# Altium schematic sheet OSSI-1 COMMS_3.SchDoc: TITLE:
size 410 x 286 mm; Date: Date:; >LAST_DATE_TIME: 01/11/2015 13:25:23; Sheet:: Sheet:; >SHEET: 4; REV:: REV:; Document Number:: Document Number:; >DRAWING_NAME: OSSI-1 COMMS.sch
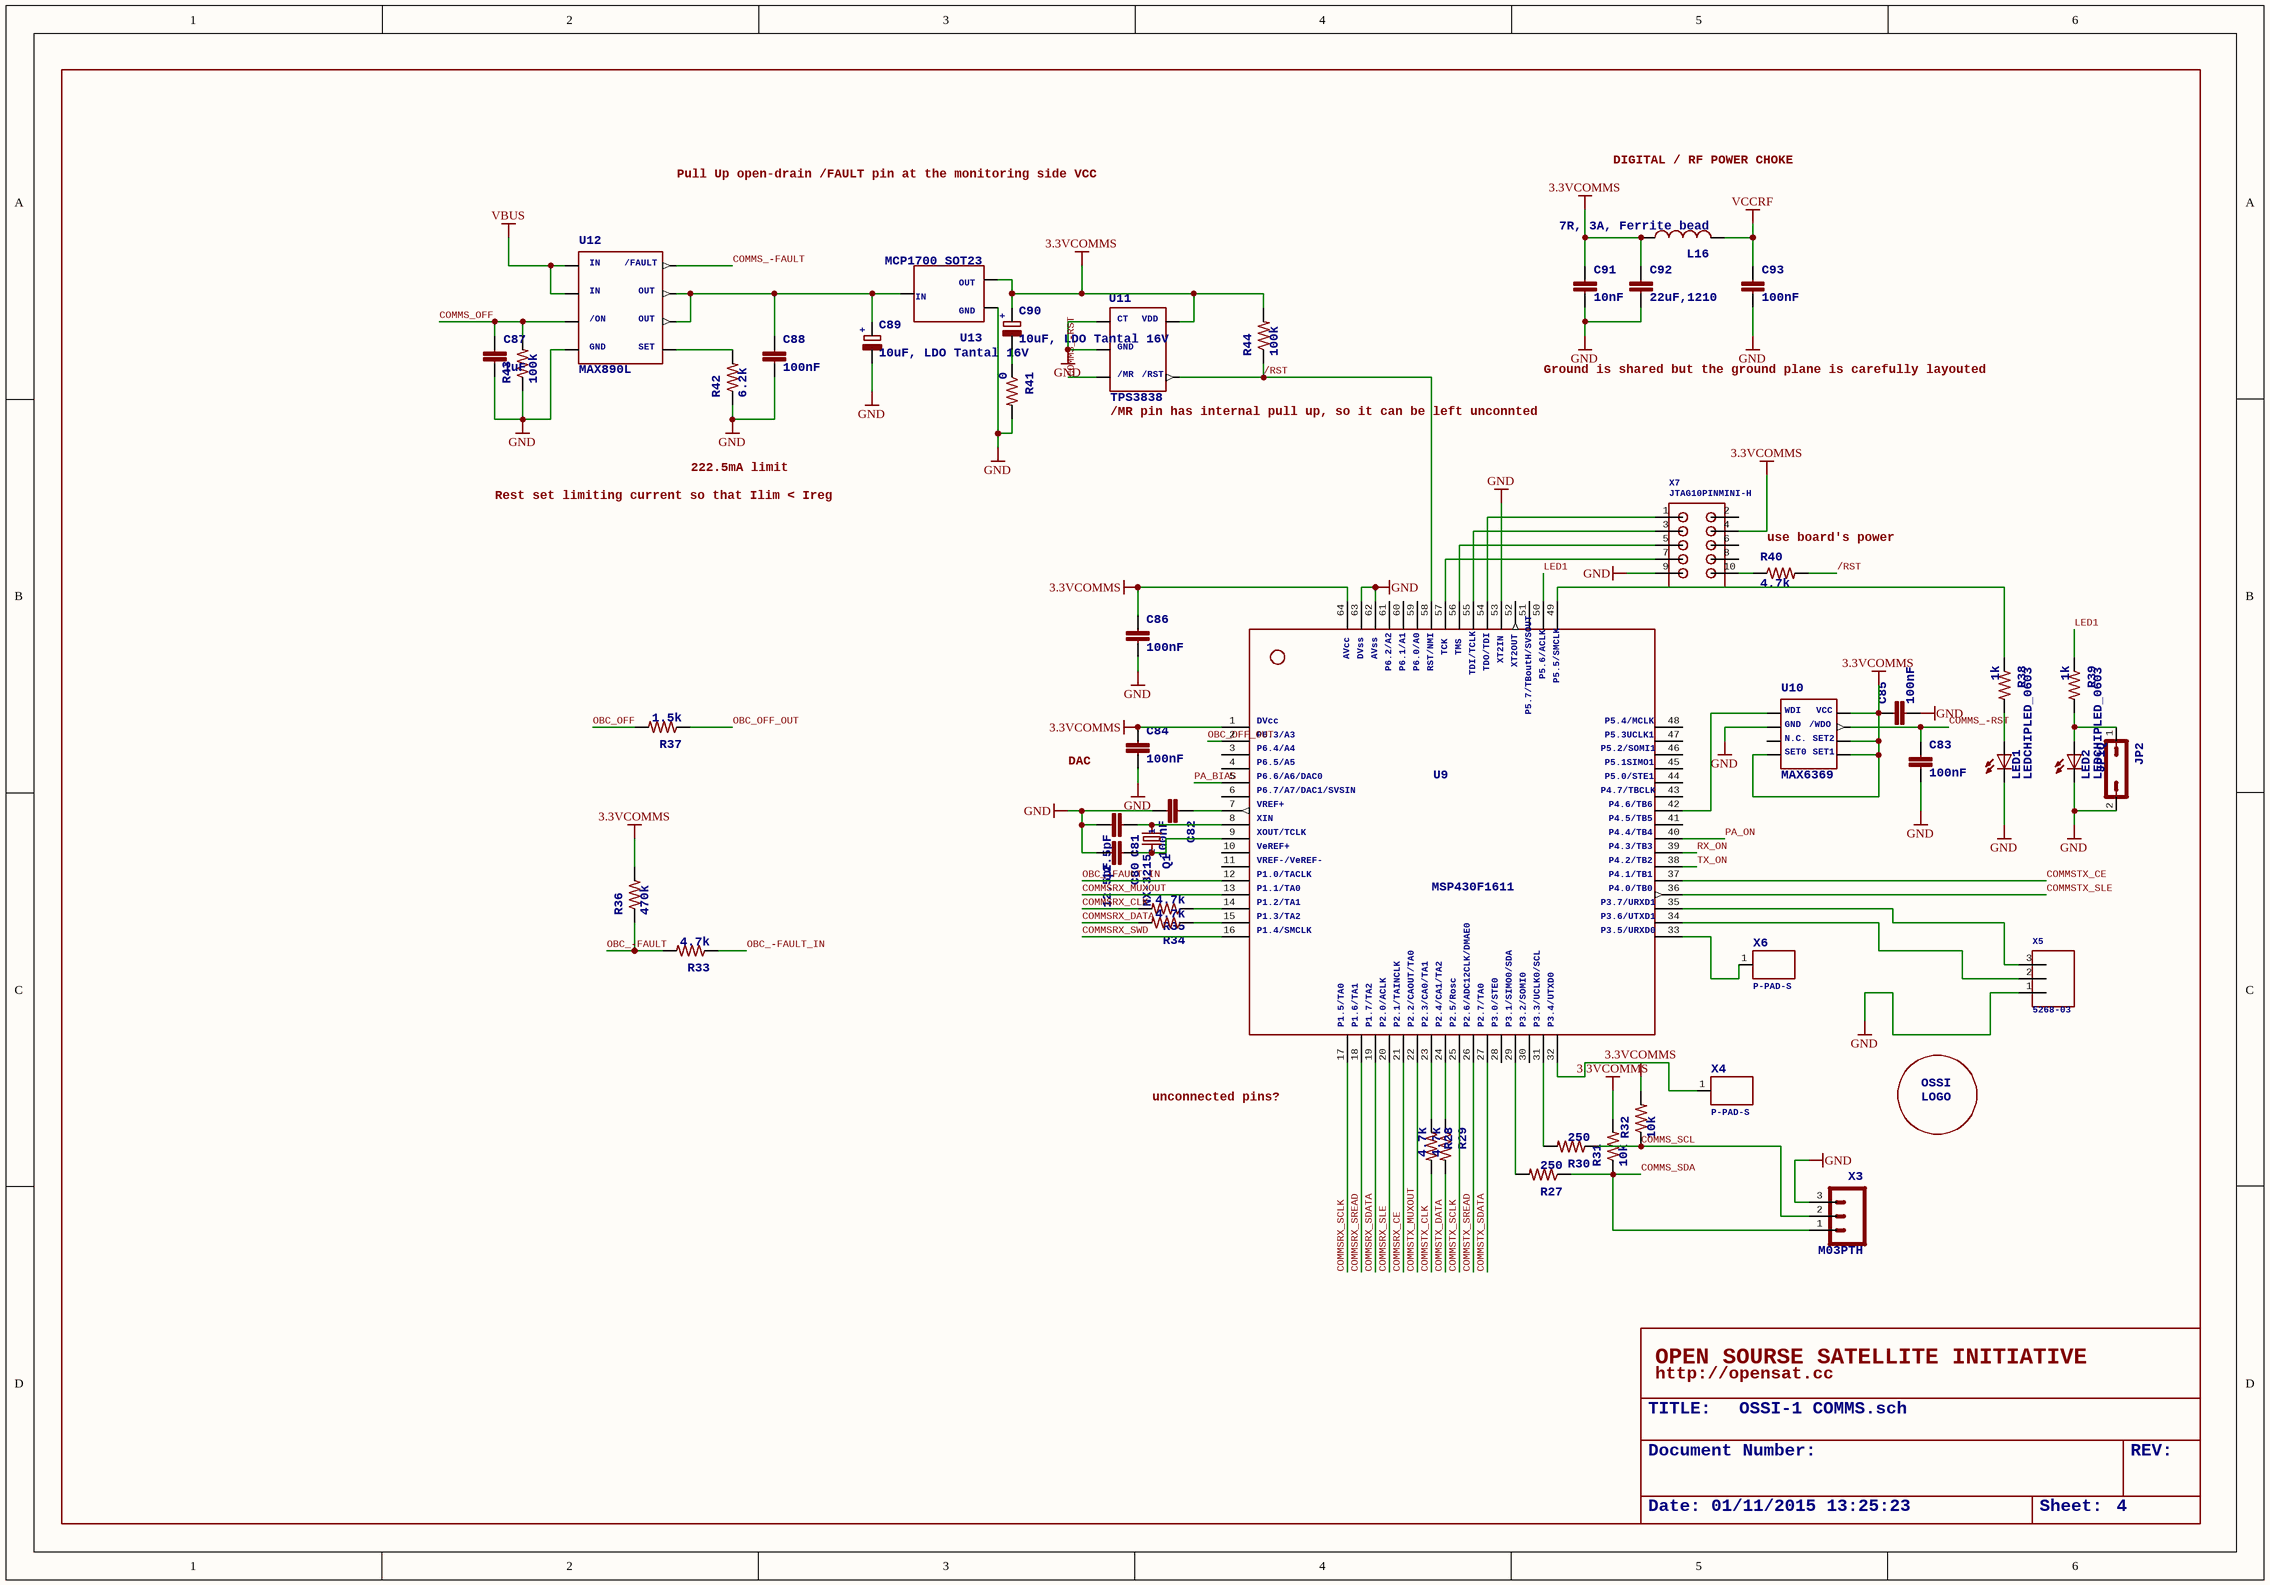
[diagram p0: OSSI-1 COMMS_3.SchDoc]

## Parts
C80  >NAME: C80  [C0603(1608)]  (hidden comment: 12.5pF)
C81  >NAME: C81  [C0603(1608)]  (hidden comment: 12.5pF)
C82  >NAME: C82  [C0603(1608)]  (hidden comment: 100nF)
C83  >NAME: C83  [C0603(1608)]  (hidden comment: 100nF)
C84  >NAME: C84  [C0603(1608)]  (hidden comment: 100nF)
C85  >NAME: C85  [C0603(1608)]  (hidden comment: 100nF)
C86  >NAME: C86  [C0603(1608)]  (hidden comment: 100nF)
C87  >NAME: C87  [C0603(1608)]  (hidden comment: 1uF)
C88  >NAME: C88  [C0603(1608)]  (hidden comment: 100nF)
C89  >NAME: C89  [C1206(3216)-A]  (hidden comment: 10uF, LDO Tantal 16V)
C90  >NAME: C90  [C1206(3216)-A]  (hidden comment: 10uF, LDO Tantal 16V)
C91  >NAME: C91  [C0603(1608)]  (hidden comment: 10nF)
C92  >NAME: C92  [C1210-GCM32]  (hidden comment: 22uF,1210)
C93  >NAME: C93  [C0603(1608)]  (hidden comment: 100nF)
JP2  >NAME: JP2  [JP1]  (hidden comment: JP1Q)
L16  >NAME: L16  [L0805(2012)]  (hidden comment: 7R, 3A, Ferrite bead)
LED1  >NAME: LED1  [CHIPLED_0603]  (hidden comment: LEDCHIPLED_0603)
LED2  >NAME: LED2  [CHIPLED_0603]  (hidden comment: LEDCHIPLED_0603)
Q1  >NAME: Q1  [NX-3215]  (hidden comment: NX-3215)
R27  >NAME: R27  [R0603(1608)]  (hidden comment: 250)
R28  >NAME: R28  [R0603(1608)]  (hidden comment: 4.7k)
R29  >NAME: R29  [R0603(1608)]  (hidden comment: 4.7k)
R30  >NAME: R30  [R0603(1608)]  (hidden comment: 250)
R31  >NAME: R31  [R0603(1608)]  (hidden comment: 10k)
R32  >NAME: R32  [R0603(1608)]  (hidden comment: 10k)
R33  >NAME: R33  [R0603(1608)]  (hidden comment: 4.7k)
R34  >NAME: R34  [R0603(1608)]  (hidden comment: 4.7k)
R35  >NAME: R35  [R0603(1608)]  (hidden comment: 4.7k)
R36  >NAME: R36  [R0603(1608)]  (hidden comment: 470k)
R37  >NAME: R37  [R0603(1608)]  (hidden comment: 1.5k)
R38  >NAME: R38  [R0603(1608)]  (hidden comment: 1k)
R39  >NAME: R39  [R0603(1608)]  (hidden comment: 1k)
R40  >NAME: R40  [R0603(1608)]  (hidden comment: 4.7k)
R41  >NAME: R41  [R0603(1608)]  (hidden comment: 0)
R42  >NAME: R42  [R0603(1608)]  (hidden comment: 6.2k)
R43  >NAME: R43  [R0603(1608)]  (hidden comment: 100k)
R44  >NAME: R44  [R0603(1608)]  (hidden comment: 100k)
U9  >NAME: U9  [PM/PAG64]  (hidden comment: MSP430F1611)
U10  >NAME: U10  [SOT23-8]  (hidden comment: MAX6369)
U11  >NAME: U11  [SOT23-5DBV]  (hidden comment: TPS3838)
U12  >NAME: U12  [SO8]  (hidden comment: MAX890L)
U13  >NAME: U13  [SOT23]  (hidden comment: MCP1700_SOT23)
U$1  OSSILOGORECT  [OSSILOGORECT1005]  (value not drawn)
X3  >NAME: X3  [1X03]  (hidden comment: M03PTH)
X4  >NAME: X4  [P-PAD-S]  (hidden comment: P-PAD-S)
X5  >NAME: X5  [5268-03]  (hidden comment: 5268-03)
X6  >NAME: X6  [P-PAD-S]  (hidden comment: P-PAD-S)
X7  >NAME: X7  [M50-3200545]  (hidden comment: JTAG10PINMINI-H)

## Nets
3.3VCOMMS: C84.1 C85.1 C86.1 C90.1(+) C91.1 C92.P$1 L16.1 R31.2 R32.2 R36.2 R44.2 U9.1 U9.64 U10.4(P$4) U10.5(P$5) U10.6(P$6) U10.8(P$8) U11.5(P$5) U13.2 X7.4
GND: C80.2 C81.2 C82.2 C83.2 C84.2 C85.2 C86.2 C87.2 C88.2 C89.2(-) C91.2 C92.P$2 C93.2 JP2.2 LED1.C LED2.C R41.2 R42.1 R43.1 U9.53 U9.62 U9.63 U10.2(P$2) U11.1(P$1) U11.2(P$2) U12.4(P$4) U13.1 X3.3 X5.1 X7.9
VBUS: U12.1(P$1) U12.2(P$2)
VCCRF: C93.1 L16.2
/RST: R40.2 R44.1 U9.58 U11.4(P$4)
COMMS_-FAULT: U12.8(P$8)
COMMS_-RST: C83.1 U10.7(P$7) U11.3(P$3)
COMMS_OFF: C87.1 R43.2 U12.3(P$3)
COMMS_SCL: R30.1 R32.1 X3.2
COMMS_SDA: R27.1 R31.1 X3.1
COMMSRX_CE: U9.21
COMMSRX_CLK: R35.2
COMMSRX_DATA: R34.2
COMMSRX_MUXOUT: U9.13
COMMSRX_SCLK: U9.17
COMMSRX_SDATA: U9.19
COMMSRX_SLE: U9.20
COMMSRX_SREAD: U9.18
COMMSRX_SWD: U9.16
COMMSTX_CE: U9.37
COMMSTX_CLK: R28.2
COMMSTX_DATA: R29.2
COMMSTX_MUXOUT: U9.22
COMMSTX_SCLK: U9.25
COMMSTX_SDATA: U9.27
COMMSTX_SLE: U9.36
COMMSTX_SREAD: U9.26
LED1: R39.1 U9.50
OBC_-FAULT: R33.2 R36.1
OBC_-FAULT_IN: R33.1 U9.12
OBC_OFF: R37.2
OBC_OFF_OUT: R37.1 U9.2
PA_BIAS: U9.5
PA_ON: U9.40
RX_ON: U9.39
TX_ON: U9.38
NetC80_1: C80.1 Q1.2 U9.9
NetC81_1: C81.1 Q1.1 U9.8
NetC82_1: C82.1 U9.7
NetC88_1: C88.1 C89.1(+) U12.6(P$6) U12.7(P$7) U13.3
NetC90_2: C90.2(-) R41.1
NetJP2_1: JP2.1 LED2.A R39.2
NetLED1_A: LED1.A R38.2
NetR27_2: R27.2 U9.29
NetR28_1: R28.1 U9.23
NetR29_1: R29.1 U9.24
NetR30_2: R30.2 U9.31
NetR34_1: R34.1 U9.15
NetR35_1: R35.1 U9.14
NetR38_1: R38.1 U9.49
NetR40_1: R40.1 X7.10
NetR42_2: R42.2 U12.5(P$5)
NetU9_32: U9.32 X4.1(P$1)
NetU9_33: U9.33 X6.1(P$1)
NetU9_34: U9.34 X5.2
NetU9_35: U9.35 X5.3
NetU9_42: U9.42 U10.1(P$1)
NetU9_54: U9.54 X7.1
NetU9_55: U9.55 X7.3
NetU9_56: U9.56 X7.5
NetU9_57: U9.57 X7.7

Not connected (* = marked no-connect by the designer): U9 3 4 6 10 11 28 30 41 43 44 45 46 47 48 51 52 59 60 61; U10 3(P$3); X7 2 6 8

## Notes on the sheet
- Pull Up open-drain /FAULT pin at the monitoring side VCC
- DIGITAL / RF POWER CHOKE
- (near U11) /MR pin has internal pull up, so it can be left unconnted
- Ground is shared but the ground plane is carefully layouted
- 222.5mA limit
- Rest set limiting current so that Ilim < Ireg
- (near R40) use board's power
- DAC
- unconnected pins?
- OPEN SOURSE SATELLITE INITIATIVE
- http://opensat.cc

## Library data of the parts
C80-C88 C91 C93 = C0603(1608)
  C80 C81: >VALUE: 12.5pF
  C82-C86 C88 C93: >VALUE: 100nF
  C87: >VALUE: 1uF
  C91: >VALUE: 10nF
C89 C90 = C-TANTAL-A: <b>TAJA105M020RNJ</b> / <ul> / <li>Tantal Capacitor / </li> / <li>Manufacturer: AVX / </li> / <li>1206(3126) / </li> / <li>Ref: www.avx.com/docs/techinfo/tantappl.pdf</li> / </ul>; +: +; >VALUE: 10uF, LDO Tantal 16V
C92 = C1210(3225)-GCM32: >VALUE: 22uF,1210
JP2 = JP1Q: <b>JUMPER</b>; >VALUE: JP1Q
L16 = L0805(2012): >VALUE: 7R, 3A, Ferrite bead
LED1 LED2 = LEDCHIPLED_0603: <b>LED</b><p> / <u>OSRAM</u>:<br> / - <u>CHIPLED</u><br> / LG R971, LG N971, LY N971, LG Q971, LY Q971, LO R971, LY R971 / LH N974, LH R974<br> / LS Q976, LO Q976, LY Q976<br> / LO Q996<br> / - <u>Hyper CHIPLED</u><br> / LW Q18S<br> / LB Q993, LB Q99A, LB R99A<br> / - <u>SideLED</u><br> / LS A670, LO A670, LY A670, LG A670, LP A670<br> / LB A673, LV A673, LT A673, LW A673<br> / LH A674<br> / LY A675<br> / LS A676, LA A676, LO A676, LY A676, LW A676<br> / LS A679, LY A679, LG A679<br> / -  <u>Hyper Micro SIDELED®</u><br> / LS Y876, LA Y876, LO Y876, LY Y876<br> / LT Y87S<br> / - <u>SmartLED</u><br> / LW L88C, LW L88S<br> / LB L89C, LB L89S, LG L890<br> / LS L89K, LO L89K, LY L89K<br> / LS L896, LA L896, LO L896, LY L896<br> / - <u>TOPLED</u><br> / LS T670, LO T670, LY T670, LG T670, LP T670<br> / LSG T670, LSP T670, LSY T670, LOP T670, LYG T670<br> / LG T671, LOG T671, LSG T671<br> / LB T673, LV T673, LT T673, LW T673<br> / LH T674<br> / LS T676, LA T676, LO T676, LY T676, LB T676, LH T676, LSB T676, LW T676<br> / LB T67C, LV T67C, LT T67C, LS T67K, LO T67K, LY T67K, LW E67C<br> / LS E67B, LA E67B, LO E67B, LY E67B, LB E67C, LV E67C, LT E67C<br> / LW T67C<br> / LS T679, LY T679, LG T679<br> / LS T770, LO T770, LY T770, LG T770, LP T770<br> / LB T773, LV T773, LT T773, LW T773<br> / LH T774<br> / LS E675, LA E675, LY E675, LS T675<br> / LS T776, LA T776, LO T776, LY T776, LB T776<br> / LHGB T686<br> / LT T68C, LB T68C<br> / - <u>Hyper Mini TOPLED®</u><br> / LB M676<br> / - <u>Mini TOPLED Santana®</u><br> / LG M470<br> / LS M47K, LO M47K, LY M47K / <p> / Source: http://www.osram.convergy.de<p> / <u>LUXEON:</u><br> / - <u>LUMILED®</u><br> / LXK2-PW12-R00, LXK2-PW12-S00, LXK2-PW14-U00, LXK2-PW14-V00<br> / LXK2-PM12-R00, LXK2-PM12-S00, LXK2-PM14-U00<br> / LXK2-PE12-Q00, LXK2-PE12-R00, LXK2-PE12-S00, LXK2-PE14-T00, LXK2-PE14-U00<br> / LXK2-PB12-K00, LXK2-PB12-L00, LXK2-PB12-M00, LXK2-PB14-N00, LXK2-PB14-P00, LXK2-PB14-Q00<br> / LXK2-PR12-L00, LXK2-PR12-M00, LXK2-PR14-Q00, LXK2-PR14-R00<br> / LXK2-PD12-Q00, LXK2-PD12-R00, LXK2-PD12-S00<br> / LXK2-PH12-R00, LXK2-PH12-S00<br> / LXK2-PL12-P00, LXK2-PL12-Q00, LXK2-PL12-R00 / <p> / Source: www.luxeon.com<p> / <u>KINGBRIGHT:</U><p> / KA-3528ASYC<br> / Source: www.kingbright.com; >VALUE: LEDCHIPLED_0603
Q1 = NX-3215: NDK 32.768 kHz SMD Crystal<br /> / P/N: NX3215SA-32.768K-STD-MUA-9<br /> / <br /> / <b>Nominal frequency (kHz):</b> 32.768 <br/> / <b>Package Size (L×W×H : mm):</b>  3.2×1.5×0.8 <br/> / <b>Operating Temperature Range(*1)  /  Storage Temperature Range   (°C):</b>  -40 to +85  /  -40 to +85<br/> / <b>Level of drive:</b>   0.1µW (Max. 0.5µW) <br/> / <b>Frequency Tolerance (25±3°C):</b>  ±20×10-6 <br/> / <b>Load Capacitance:</b>  9.0pF, 12.5pF <br/> / <b>Equivalent Series Resistance:</b>  70kΩ Max.<br/> / <b>Ordering Code:</b>  NX3215SA-32.768K-STD-MUA-9 (Load Capacitance9.0pF) /NX3215SA-32.768K-STD-MUA-8 (Load Capacitance12.5pF); >VALUE: NX-3215; 1: 1; 2: 2
R27-R44 = R0603(1608)
  R27 R30: >VALUE: 250
  R28 R29 R33-R35 R40: >VALUE: 4.7k
  R31 R32: >VALUE: 10k
  R36: >VALUE: 470k
  R37: >VALUE: 1.5k
  R38 R39: >VALUE: 1k
  R41: >VALUE: 0
  R42: >VALUE: 6.2k
  R43 R44: >VALUE: 100k
U9 = MSP430F1611: <b>MSP430F1611</b>; AVcc: AVcc; DVss: DVss; AVss: AVss; P6.2/A2: P6.2/A2; P6.1/A1: P6.1/A1; P6.0/A0: P6.0/A0; RST/NMI: RST/NMI; TCK: TCK; TMS: TMS; TDI/TCLK: TDI/TCLK; TDO/TDI: TDO/TDI; XT2IN: XT2IN; XT2OUT: XT2OUT; P5.7/TBoutH/SVSOUT: P5.7/TBoutH/SVSOUT; P5.6/ACLK: P5.6/ACLK; P5.5/SMCLK: P5.5/SMCLK; DVcc: DVcc; P6.3/A3: P6.3/A3; P6.4/A4: P6.4/A4; P6.5/A5: P6.5/A5; P6.6/A6/DAC0: P6.6/A6/DAC0; P6.7/A7/DAC1/SVSIN: P6.7/A7/DAC1/SVSIN; VREF+: VREF+; XIN: XIN; XOUT/TCLK: XOUT/TCLK; VeREF+: VeREF+; VREF-/VeREF-: VREF-/VeREF-; P1.0/TACLK: P1.0/TACLK; P1.1/TA0: P1.1/TA0; P1.2/TA1: P1.2/TA1; P1.3/TA2: P1.3/TA2; P1.4/SMCLK: P1.4/SMCLK; P1.5/TA0: P1.5/TA0; P1.6/TA1: P1.6/TA1; P1.7/TA2: P1.7/TA2; P2.0/ACLK: P2.0/ACLK; P2.1/TAINCLK: P2.1/TAINCLK; P2.2/CAOUT/TA0: P2.2/CAOUT/TA0; P2.3/CA0/TA1: P2.3/CA0/TA1; P2.4/CA1/TA2: P2.4/CA1/TA2; P2.5/Rosc: P2.5/Rosc; P2.6/ADC12CLK/DMAE0: P2.6/ADC12CLK/DMAE0; P2.7/TA0: P2.7/TA0; P3.0/STE0: P3.0/STE0; P3.1/SIMO0/SDA: P3.1/SIMO0/SDA; P3.2/SOMI0: P3.2/SOMI0; P3.3/UCLK0/SCL: P3.3/UCLK0/SCL; P3.4/UTXD0: P3.4/UTXD0; P5.4/MCLK: P5.4/MCLK; P5.3UCLK1: P5.3UCLK1; P5.2/SOMI1: P5.2/SOMI1; P5.1SIMO1: P5.1SIMO1; P5.0/STE1: P5.0/STE1; P4.7/TBCLK: P4.7/TBCLK; P4.6/TB6: P4.6/TB6; P4.5/TB5: P4.5/TB5; P4.4/TB4: P4.4/TB4; P4.3/TB3: P4.3/TB3; P4.2/TB2: P4.2/TB2; P4.1/TB1: P4.1/TB1; P4.0/TB0: P4.0/TB0; P3.7/URXD1: P3.7/URXD1; P3.6/UTXD1: P3.6/UTXD1; P3.5/URXD0: P3.5/URXD0; >VALUE: MSP430F1611
U10 = MAX6369: <B>MAX6369</B> / <ul> / <li>Pin-Selectable Watchdog Timers</li> / <li>Max 6369 is Open-drain output</li> / <li>1 ms to 60 s seletable timeout</li> / </ul>; WDI: WDI; GND: GND; N.C.: N.C.; SET0: SET0; SET1: SET1; SET2: SET2; /WDO: /WDO; VCC: VCC; >VALUE: MAX6369
U11 = TPS3838: <b>TPS3838</b> / <br /> / NanoPower Supervisory IC from texas instruments.<br /> / TPS3838 is open-drain output; >VALUE: TPS3838; CT: CT; /MR: /MR; GND: GND; VDD: VDD; /RST: /RST
U12 = MAX890L: <B>MAX 890L</B> / <BR /> / 1.2A, Current-Limited, High-Side / P-Channel Switch with Thermal Shutdown BY MAXIM; IN: IN; /ON: /ON; GND: GND; SET: SET; OUT: OUT; /FAULT: /FAULT; >VALUE: MAX890L
U13 = MCP1700_SOT23: MCP1700 LDO from Microchips; >VALUE: MCP1700_SOT23; IN: IN; GND: GND; OUT: OUT
X3 = M03PTH: <b>Header 3</b> / Standard 3-pin 0.1" header. Use with straight break away headers (SKU : PRT-00116), right angle break away headers (PRT-00553), swiss pins (PRT-00743), machine pins (PRT-00117), and female headers (PRT-00115). Molex polarized connector foot print use with SKU : PRT-08232 with associated crimp pins and housings.; >VALUE: M03PTH
U$1 = OSSILOGORECT: OSSI: OSSI; LOGO: LOGO
X4 X6 = P-PAD-S: >VALUE: P-PAD-S
X5 = 5268-03: >VALUE: 5268-03
X7 = JTAG10PINMINI-H: >VALUE: JTAG10PINMINI-H